# Altium schematic sheet Boat_Receiver.SchDoc
size A; SheetNumber: 1; SheetTotal: 5
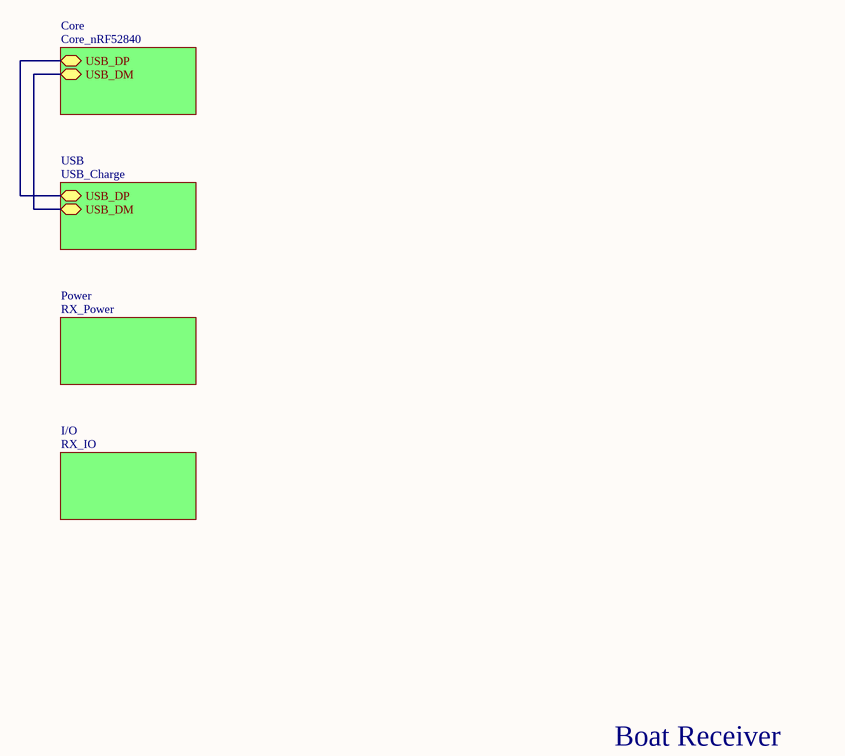
[diagram p0: Boat_Receiver.SchDoc]

## Sub-sheets
Core = Core_nRF52840: USB_DP (bidir), USB_DM (bidir)
I/O = RX_IO: no entries
Power = RX_Power: no entries
USB = USB_Charge: USB_DP (bidir), USB_DM (bidir)

## Nets
(unnamed): sheet USB/USB_DP, sheet Core/USB_DP
(unnamed): sheet USB/USB_DM, sheet Core/USB_DM

## Notes on the sheet
- Boat Receiver